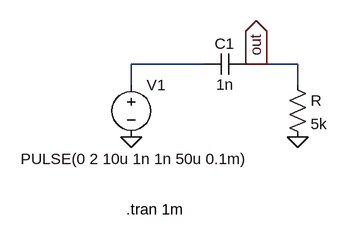
[diagram p0: schematic question15.asc]
question15.asc, the LTspice schematic file:
Version 4
SHEET 1 880 680
WIRE 160 96 48 96
WIRE 240 96 224 96
WIRE 304 96 240 96
WIRE 48 128 48 96
WIRE 304 128 304 96
FLAG 48 208 0
FLAG 240 96 out
IOPIN 240 96 Out
FLAG 304 208 0
SYMBOL voltage 48 112 R0
WINDOW 3 -170 130 Left 2
WINDOW 123 0 0 Left 0
WINDOW 39 0 0 Left 0
SYMATTR Value PULSE(0 2 10u 1n 1n 50u 0.1m)
SYMATTR InstName V1
SYMBOL cap 224 80 R90
WINDOW 0 0 32 VBottom 2
WINDOW 3 32 32 VTop 2
SYMATTR InstName C1
SYMATTR Value 1n
SYMBOL res 288 112 R0
SYMATTR InstName R
SYMATTR Value 5k
TEXT 40 320 Left 2 !.tran 1m

The netlist it stands for:
* question15.asc
V1 N001 0 PULSE(0 2 10u 1n 1n 50u 0.1m)
C1 out N001 1n
R out 0 5k
.tran 1m
.backanno
.end